# Altium schematic sheet AMU-S25-V00-DAUGHTERIMDConnection.SchDoc: IMD Connection
size A3; DrawnBy: Alikhan Hassan; DocumentNumber: 6; Revision: 00; SheetNumber: 22; SheetTotal: 31; Version: 01; Project: IMD Daughter Board 2020
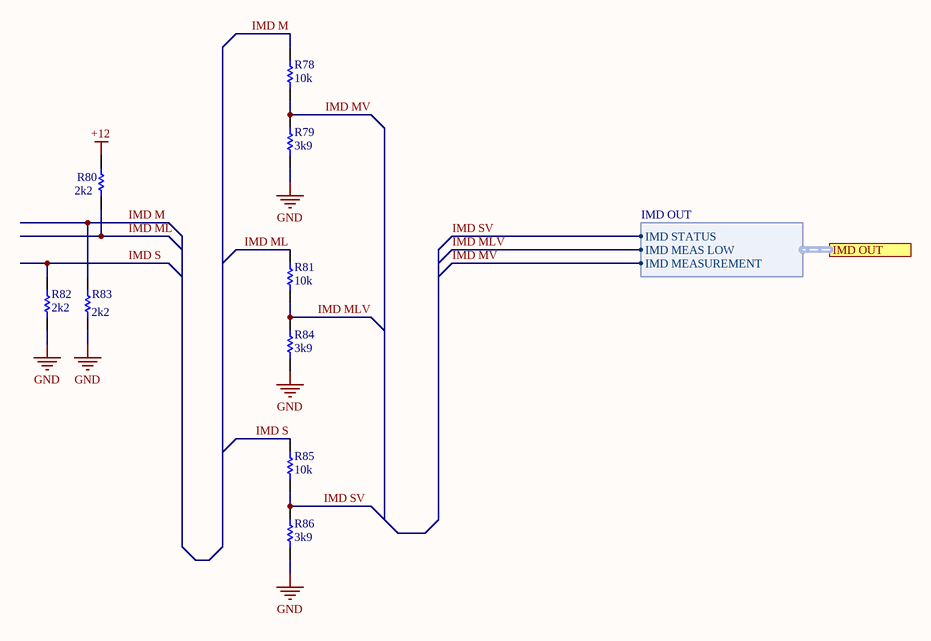
[diagram p0: AMU-S25-V00-DAUGHTERIMDConnection.SchDoc]

## Parts
R78  10k  [Res_ThinFilm_0603]
R79  3k9  [Res_ThinFilm_0603]
R80  2k2  [Res_ThinFilm_0603]
R81  10k  [Res_ThinFilm_0603]
R82  2k2  [Res_ThinFilm_0603]
R83  2k2  [Res_ThinFilm_0603]
R84  3k9  [Res_ThinFilm_0603]
R85  10k  [Res_ThinFilm_0603]
R86  3k9  [Res_ThinFilm_0603]

## Ports
IMD OUT (harness IMD OUT)

## Harnesses
IMD OUT: IMD MEASUREMENT, IMD MEAS LOW, IMD STATUS

## Nets
+12: R80.2
GND: R79.1 R82.1 R83.1 R84.1 R86.1
IMD M: R78.2 R83.2
IMD ML: R80.1 R81.2
IMD MLV: R81.1 R84.2 ; port IMD OUT.IMD MEAS LOW
IMD MV: R78.1 R79.2 ; port IMD OUT.IMD MEASUREMENT
IMD S: R82.2 R85.2
IMD SV: R85.1 R86.2 ; port IMD OUT.IMD STATUS

## Notes on the sheet
- Revision History:
- Sheet Title:
- Rev
- Date
- Description
- Project:
- Size:
- Drawn By:
- A3
- Number:
- Revision:
- Sheet
- Version:
- of
- QUT Motorsport
- O-120, Gardens Point
- 2 George Street
- Brisbane, QLD 4000
- Australia
- Print Date:
- Print Time:
- File Name:

## Library data of the parts
R78 R81 R85 = 10k 1% 0603: Resistor, SMD, 10k, 0.1W, 1%, 0603
R79 R84 R86 = 3k9 5% 0603: Resistor, SMD, 3k9, 0.1W, 5%, 0603
R80 R82 R83 = 2k2 5% 0603: Resistor, SMD, 2k2, 0.1W, 5%, 0603